# EAGLE design 206eBreakout (EAGLE 7.4.0)
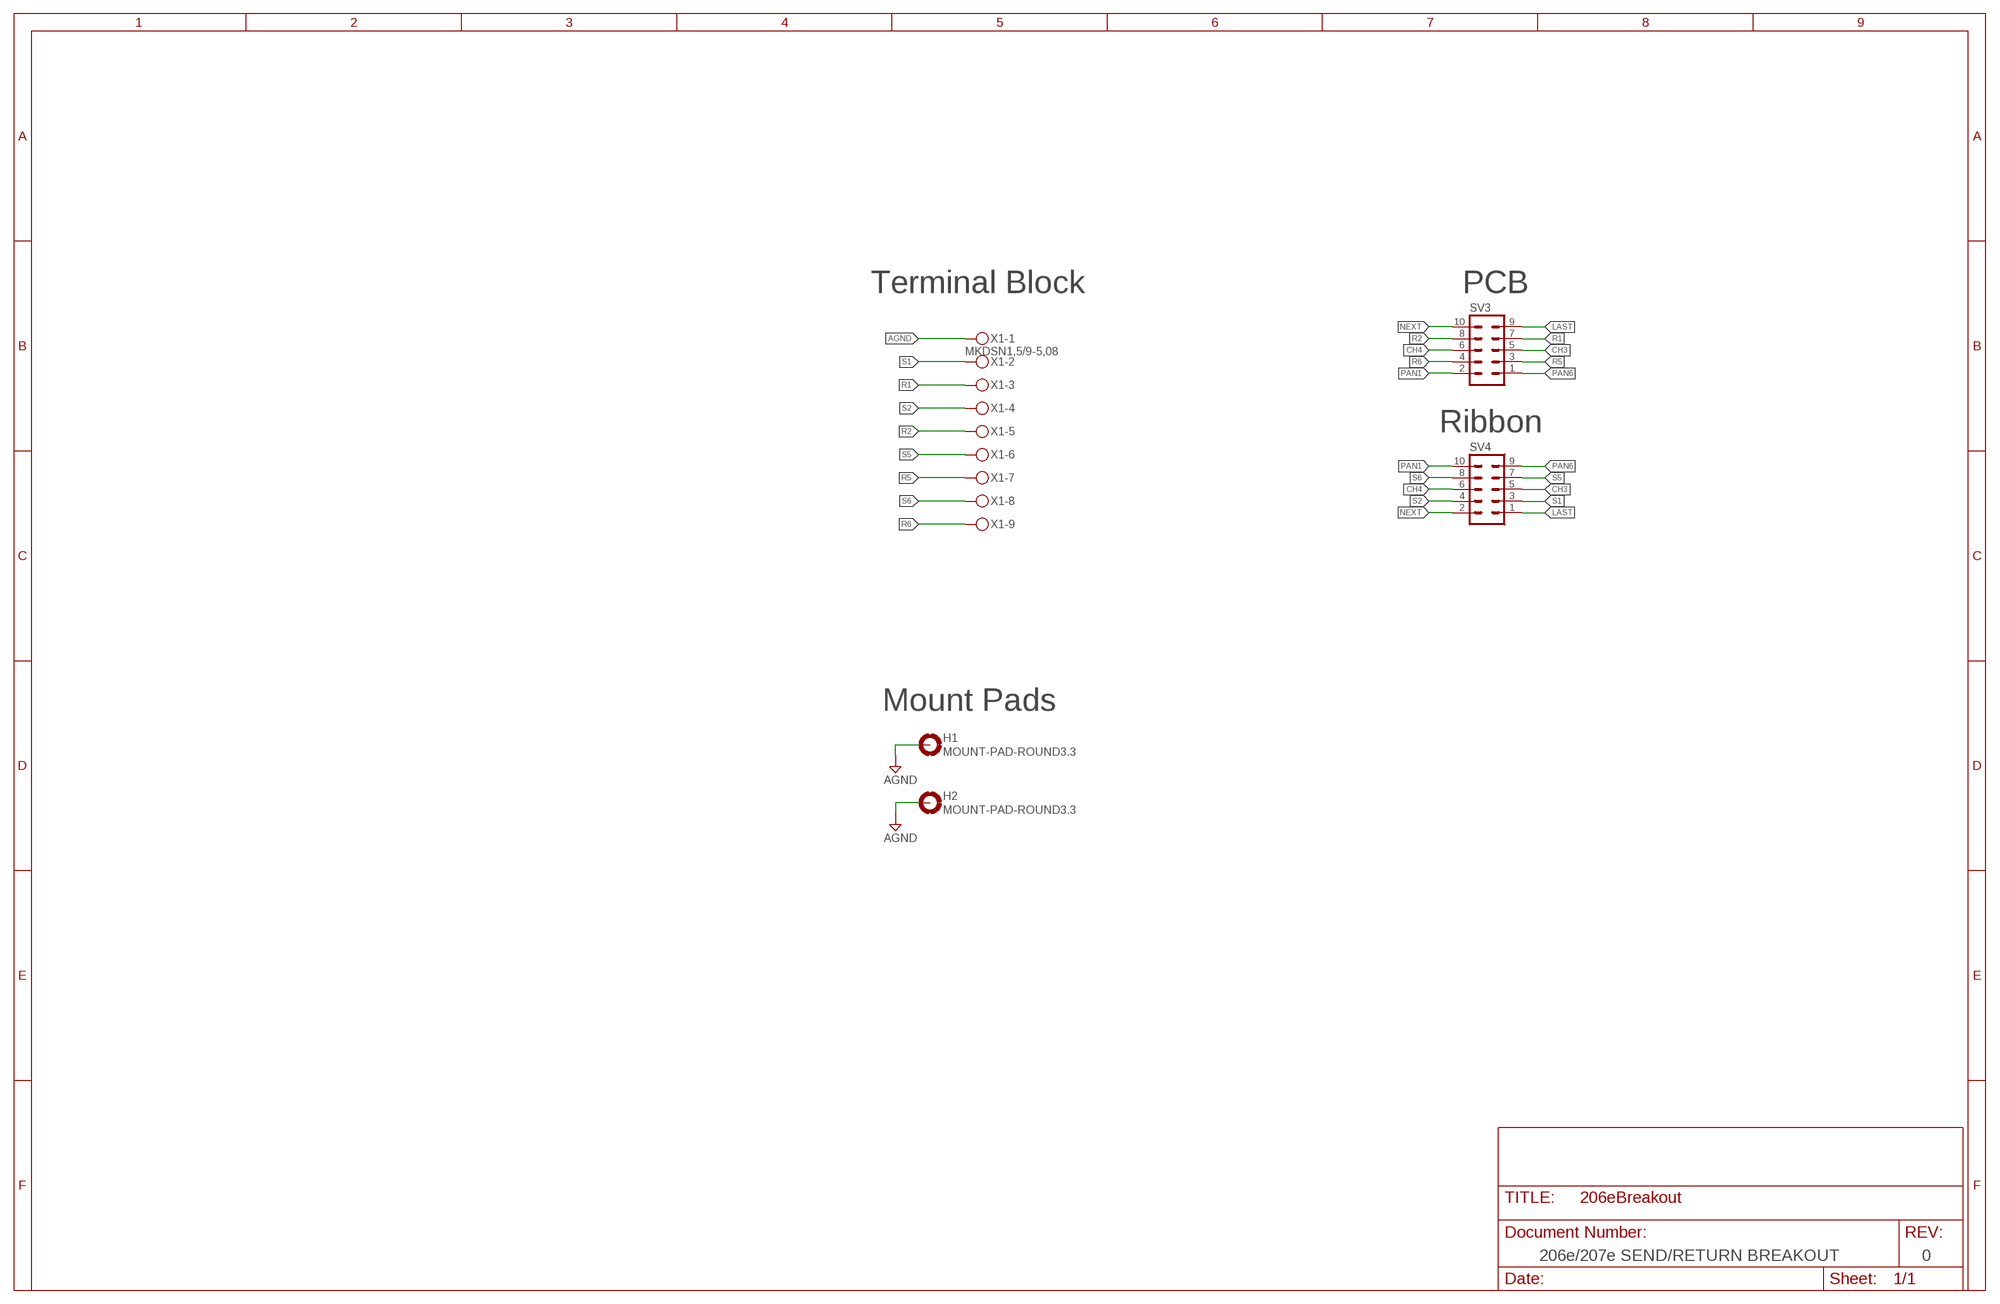
[diagram p0: schematic, sheet 1]

## Parts
H1  MOUNT-PAD-ROUND3.3  [3,3-PAD]
H2  MOUNT-PAD-ROUND3.3  [3,3-PAD]
SV3  MA05-2  [MA05-2]
SV4  MA05-2  [MA05-2]
X1  MKDSN1,5/9-5,08  [MKDSN1,5/9-5,08]

## Nets
AGND: H1.B3,3(MOUNT) H2.B3,3(MOUNT) X1.1
CH3: SV3.5 SV4.5
CH4: SV3.6 SV4.6
LAST: SV3.9 SV4.1
NEXT: SV3.10 SV4.2
PAN1: SV3.2 SV4.10
PAN6: SV3.1 SV4.9
R1: SV3.7 X1.3
R2: SV3.8 X1.5
R5: SV3.3 X1.7
R6: SV3.4 X1.9
S1: SV4.3 X1.2
S2: SV4.4 X1.4
S5: SV4.7 X1.6
S6: SV4.8 X1.8

## Notes on the sheet
- Terminal Block | PCB
- Ribbon
- Mount Pads
- 206e/207e SEND/RETURN BREAKOUT | 0

## Library data of the parts
H1 H2 = holes:MOUNT-PAD-ROUND: MOUNTING PAD, round
SV3 SV4 = studio_h:MA05-2: PIN HEADER; MF: TE CONNECTIVITY; MPN: 4-146251-0; Z_DIGIKEY: A117616-ND; Z_MOUSER: 571-4-146251-0
X1 = con-phoenix-508:MKDSN1,5/9-5,08: MKDSN 1,5/ 9-5,08 Printklemme Nennstrom: 13,5 A Nennspannung: 250 V Rastermaß: 5,08 mm Polzahl: 9 Anschlussart: Schraubanschluss Montage: Löten Anschlussrichtung Leiter/Platine: 0 ° Artikelnummer: 1729199 Source: http://eshop.phoenixcontact.com .. 1729199.pdf

## Net classes
0 Signal: width 0.254 mm, clearance 0.205 mm
1 Power: width 0.508 mm, clearance 0.205 mm to class 0, clearance 0.205 mm
2 GND: width 0.889 mm

## Board
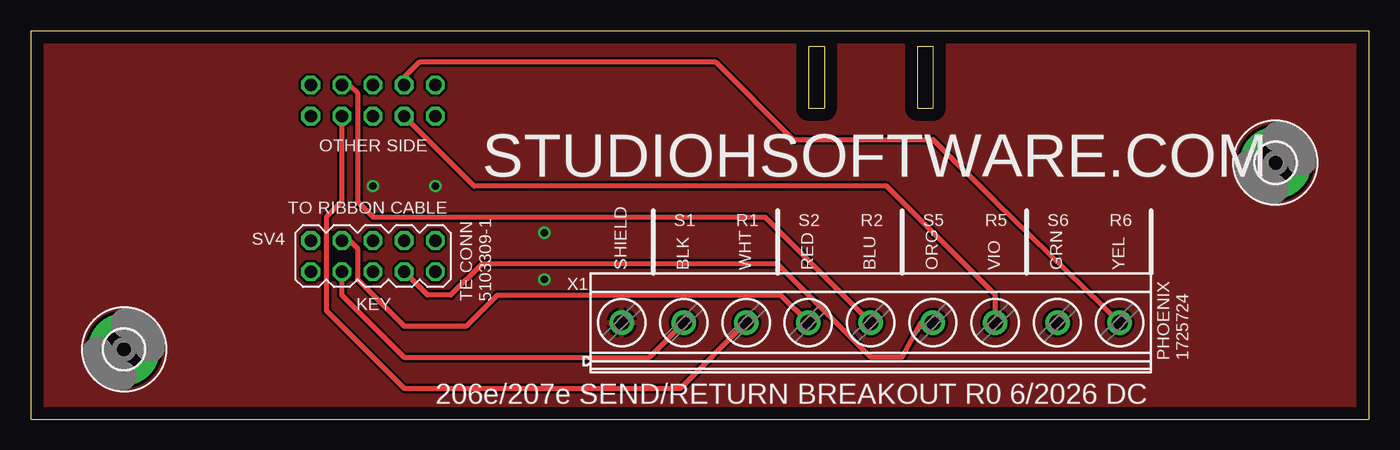
[diagram p1: board, top side]
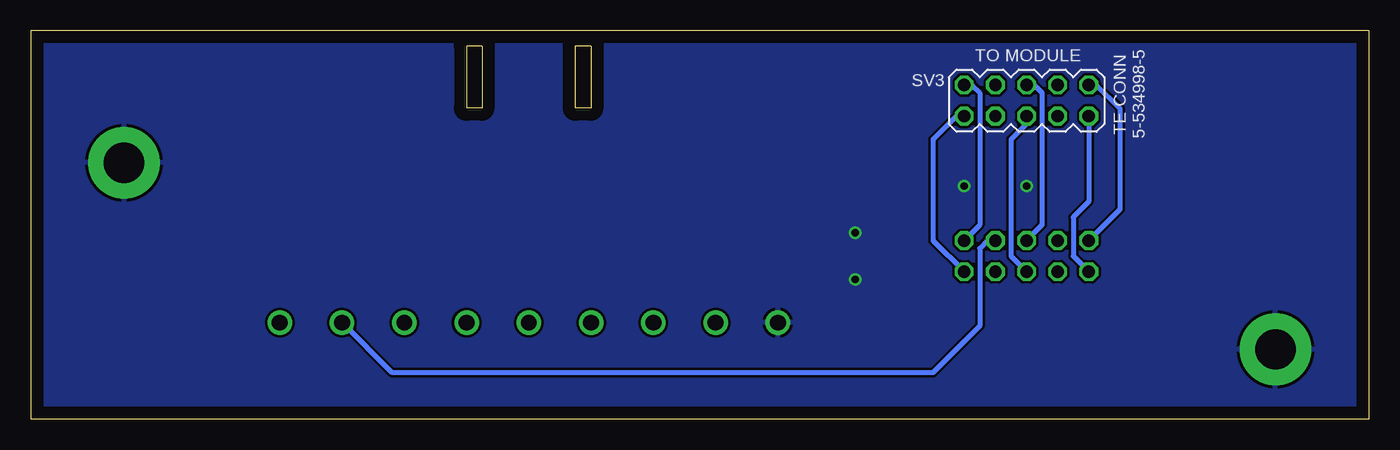
[diagram p2: board, bottom side, seen from below]

Size 109.22 x 31.75 mm. Coordinates in mm from the lower left corner, seen from the top.
Outline: 0,31.75 109.22,31.75 109.22,0 0,0 0,31.75
Outline: 72.39,30.48 72.39,25.4 73.66,25.4 73.66,30.48 72.39,30.48
Outline: 63.5,30.48 63.5,25.4 64.77,25.4 64.77,30.48 63.5,30.48
Copper layers (1*16): Top 0.035mm / dielectric 0.2mm / Bottom 0.035mm
Design rules "default *": minimum track width 10mil, minimum drill 20mil, track to track 8mil, track to pad 8mil, pad to pad 8mil, via to via 8mil, smd to smd 8mil, copper to edge 40mil, drill to drill 8mil, minimum pad ring 10mil, minimum via ring 8mil, stop-mask expansion 4mil, vias tented up to drill 0mil, thermal gap 10mil

### Footprints (pad centres in the part's own frame; a part is rotated, then mirrored left to right if it is on the bottom)
3,3-PAD = drill 3.3 pad 5.842: B3,3 0,0
MA05-2 = drill 1.016 octagon: 1 -5.08,-1.27; 2 -5.08,1.27; 3 -2.54,-1.27; 4 -2.54,1.27; 5 0,-1.27; 6 0,1.27; 7 2.54,-1.27; 8 2.54,1.27; 9 5.08,-1.27; 10 5.08,1.27
MKDSN1,5/9-5,08 = drill 1.3 pad 2: 1 -20.341,0.025; 2 -15.261,0.025; 3 -10.181,0.025; 4 -5.101,0.025; 5 -0.021,0.025; 6 5.059,0.025; 7 10.139,0.025; 8 15.219,0.025; 9 20.299,0.025

### Placement (x,y rotation side)
H1  7.62,5.71 0 top
H2  101.6,20.95 0 top
SV3  27.94,26.03 0 bottom
SV4  27.94,13.34 0 top
X1  68.58,7.87 0 top

### Tracks (layer width: path | path; a pad name or v marks a point on that pad's centre or on a via)
AGND  (via drill 0.6)
  other vias: 27.94,19.05 33.02,19.05 41.91,15.24 41.91,11.43
  pour Top: 0,0 109.22,0 109.22,31.75 0,31.75
  pour Bottom: 0,0 109.22,0 109.22,31.75 0,31.75
CH3
  Bottom 0.406: SV3.5 27.94,24.13 29.21,22.86 29.21,13.34 SV4.5
CH4
  Bottom 0.406: SV3.6 27.3,27.3 26.67,26.67 26.67,15.88 SV4.6
LAST
  Bottom 0.406: SV3.9 22.86,17.78 24.13,16.51 24.13,13.34 SV4.1
NEXT
  Bottom 0.406: SV3.10 22.22,27.3 20.32,25.4 20.32,17.14 SV4.2
PAN1
  Bottom 0.406: SV3.2 32.39,27.3 31.75,26.67 31.75,15.88 SV4.10
PAN6
  Bottom 0.406: SV3.1 33.66,24.77 35.56,22.86 35.56,14.61 SV4.9
R1
  Top 0.406: SV3.7 25.4,17.78 24.13,16.51 24.13,8.89 30.48,2.54 53.04,2.54 X1.3
R2
  Top 0.406: SV3.8 26.04,27.3 26.67,26.67 26.67,17.78 27.94,16.51 59.95,16.51 X1.5
R5
  Top 0.406: X1.7 78.72,10.18 69.85,19.05 36.2,19.05 SV3.3
R6
  Top 0.406: SV3.4 30.48,27.94 31.75,29.21 55.88,29.21 62.23,22.86 73.66,22.86 78.74,17.78 88.9,7.92 X1.9
S1
  Top 0.406: SV4.3 25.4,10.16 30.48,5.08 50.5,5.08 X1.2
S2
  Top 0.406: SV4.4 26.04,14.61 26.67,13.97 26.67,11.43 30.48,7.62 35.56,7.62 38.1,10.16 61.22,10.16 X1.4
S5
  Top 0.406: X1.6 72.67,7.9 71.12,5.08 68.58,5.08 60.96,12.7 36.83,12.7 34.29,10.16 32.39,10.16 SV4.7
S6
  Bottom 0.406: SV4.8 31.11,14.61 31.75,13.97 31.75,7.62 35.56,3.81 79.71,3.81 X1.8

### Text on the board
tPlace: OTHER SIDE | STUDIOHSOFTWARE.COM | TO RIBBON CABLE | S1 | R1 | S2 | R2 | S5 | R5 | S6 | R6 | SHIELD | BLK | WHT | RED | BLU | ORG | VIO | GRN | YEL | TE CONN / 5103309-1 | KEY | PHOENIX / 1725724 | 206e/207e SEND/RETURN BREAKOUT R0 6/2026 DC
bPlace: TE CONN / 5-534998-5 | TO MODULE